# EAGLE design psumon (EAGLE 5.12)
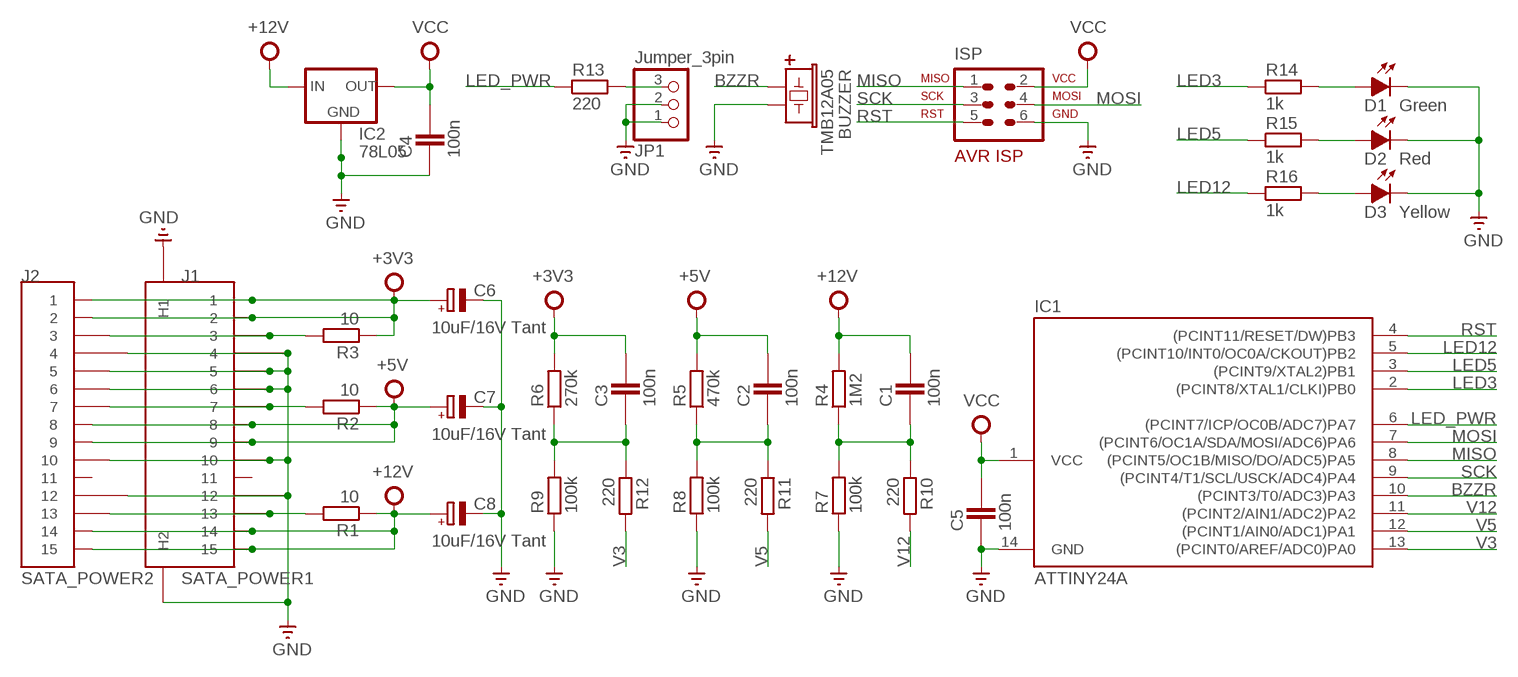
[diagram p0: schematic, sheet 1]

## Parts
BUZZER  TMB12A05  BUZZER_12_7.6  [BUZZER_12_7.6]
C1  100n  CAPACITOR_0805  [C0805]
C2  100n  CAPACITOR_0805  [C0805]
C3  100n  CAPACITOR_0805  [C0805]
C4  100n  CAPACITOR_0805  [C0805]
C5  100n  CAPACITOR_0805  [C0805]
C6  10uF/16V Tant  CAPACITORP_1206  [C1206P]
C7  10uF/16V Tant  CAPACITORP_1206  [C1206P]
C8  10uF/16V Tant  CAPACITORP_1206  [C1206P]
D1  Green  LED_0805  [D0805]
D2  Red  LED_0805  [D0805]
D3  Yellow  LED_0805  [D0805]
IC1  ATTINY24A  TINY24/44/84-SSU  [SOIC14]
IC2  78L05  L78LXXCU/BU  [SOT89]
ISP  AVR-ISP-6VERT  [AVR-ISP-6]
J1  SATA_POWER1  [SATA_POWER1]
J2  SATA_POWER2  [SATA_POWER2]
JP1  Jumper_3pin  PINHD-1X3_2.54-90°  [1X03/90]
R1  10  RESISTOR_0805  [R0805]
R2  10  RESISTOR_0805  [R0805]
R3  10  RESISTOR_0805  [R0805]
R4  1M2  RESISTOR_0805  [R0805]
R5  470k  RESISTOR_0805  [R0805]
R6  270k  RESISTOR_0805  [R0805]
R7  100k  RESISTOR_0805  [R0805]
R8  100k  RESISTOR_0805  [R0805]
R9  100k  RESISTOR_0805  [R0805]
R10  220  RESISTOR_0805  [R0805]
R11  220  RESISTOR_0805  [R0805]
R12  220  RESISTOR_0805  [R0805]
R13  220  RESISTOR_0805  [R0805]
R14  1k  RESISTOR_0805  [R0805]
R15  1k  RESISTOR_0805  [R0805]
R16  1k  RESISTOR_0805  [R0805]

## Nets
+3V3: C3.2 C6.A J1.P$1 J1.P$2 J2.P$1 J2.P$2 R3.1 R6.2
+5V: C2.2 C7.A J1.P$8 J1.P$9 J2.P$8 J2.P$9 R2.1 R5.2
+12V: C1.2 C8.A IC2.3(IN) J1.P$14 J1.P$15 J2.P$14 J2.P$15 R1.1 R4.2
BZZR: BUZZER.P$1 IC1.10((PCINT3/T0/ADC3)PA3)
GND: BUZZER.P$2 C4.1 C5.1 C6.C C7.C C8.C D1.C D2.C D3.C IC1.14(GND) IC2.2(GND) IC2.4(GND1) ISP.6 J1.P$4 J1.P$5 J1.P$6 J1.P$10 J1.P$12 J1.P$16(H1) J1.P$17(H2) J2.P$4 J2.P$5 J2.P$6 J2.P$10 J2.P$12 JP1.1 JP1.2 R7.1 R8.1 R9.1
LED3: IC1.2((PCINT8/XTAL1/CLKI)PB0) R14.1
LED5: IC1.3((PCINT9/XTAL2)PB1) R15.1
LED12: IC1.5((PCINT10/INT0/OC0A/CKOUT)PB2) R16.1
LED_PWR: IC1.6((PCINT7/ICP/OC0B/ADC7)PA7) R13.1
MISO: IC1.8((PCINT5/OC1B/MISO/DO/ADC5)PA5) ISP.1
MOSI: IC1.7((PCINT6/OC1A/SDA/MOSI/ADC6)PA6) ISP.4
N$1: JP1.3 R13.2
N$2: C1.1 R4.1 R7.2 R10.1
N$3: J1.P$3 J2.P$3 R3.2
N$4: D1.A R14.2
N$5: C2.1 R5.1 R8.2 R11.1
N$6: D2.A R15.2
N$7: C3.1 R6.1 R9.2 R12.1
N$8: D3.A R16.2
N$9: J1.P$7 J2.P$7 R2.2
N$10: J1.P$13 J2.P$13 R1.2
RST: IC1.4((PCINT11/RESET/DW)PB3) ISP.5
SCK: IC1.9((PCINT4/T1/SCL/USCK/ADC4)PA4) ISP.3
V3: IC1.13((PCINT0/AREF/ADC0)PA0) R12.2
V5: IC1.12((PCINT1/AIN0/ADC1)PA1) R11.2
V12: IC1.11((PCINT2/AIN1/ADC2)PA2) R10.2
VCC: C4.2 C5.2 IC1.1(VCC) IC2.1(OUT) ISP.2
Unconnected: J1.P$11 J2.P$11

## Library data of the parts
BUZZER = psumon:BUZZER_*
C1-C5 = psumon:CAPACITOR_
C6-C8 = psumon:CAPACITORP_
D1-D3 = psumon:LED_: LEDS
IC1 = psumon:TINY24/44/84
IC2 = psumon:L78LXXCU/BU: VOLTAGE REGULATOR
ISP = psumon:AVR-ISP-6: AVR ISP-6 Serial Programming Header
J1 = psumon:SATA_POWER
J2 = psumon:SATA_POWER2
JP1 = psumon:PINHD-1X3: PIN HEADER
R1-R16 = psumon:RESISTOR_

## Board
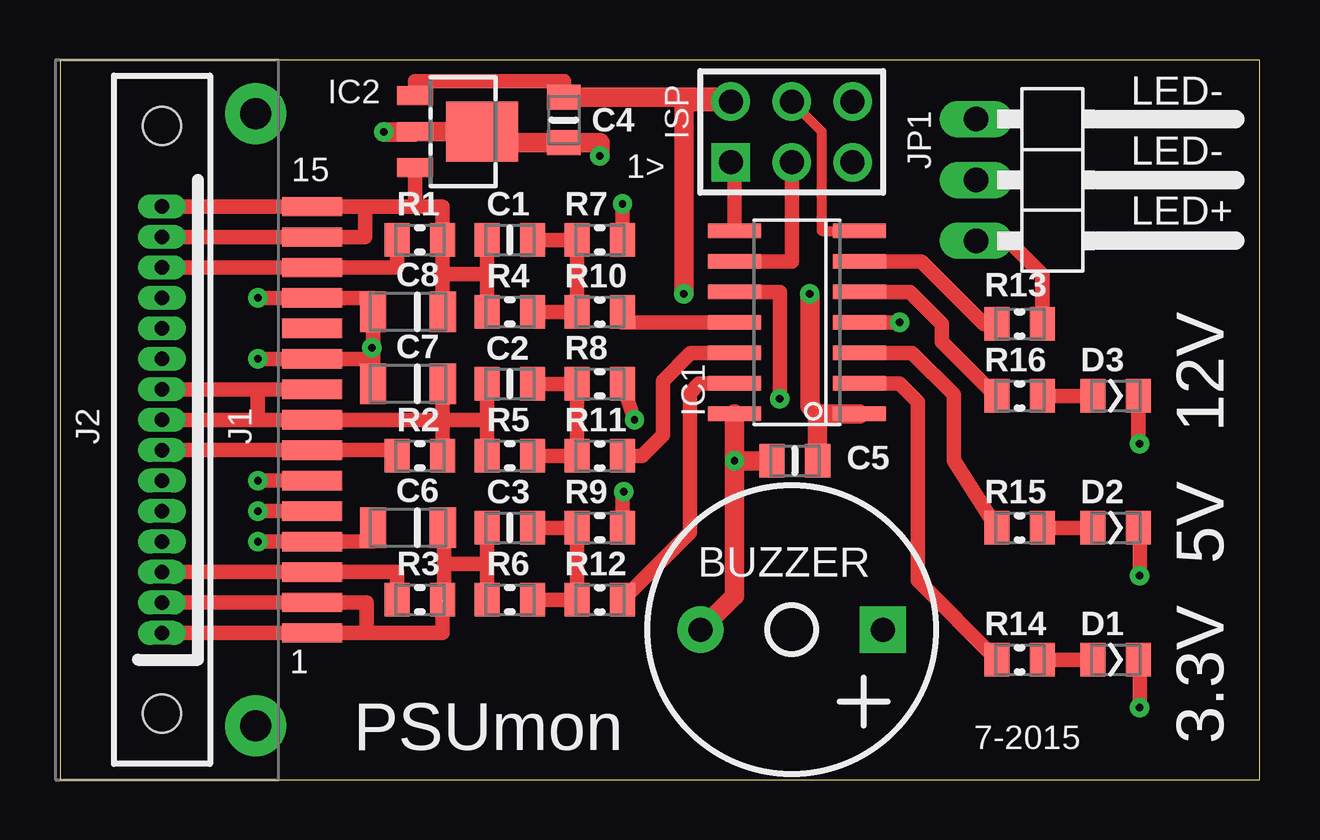
[diagram p1: board, top side]
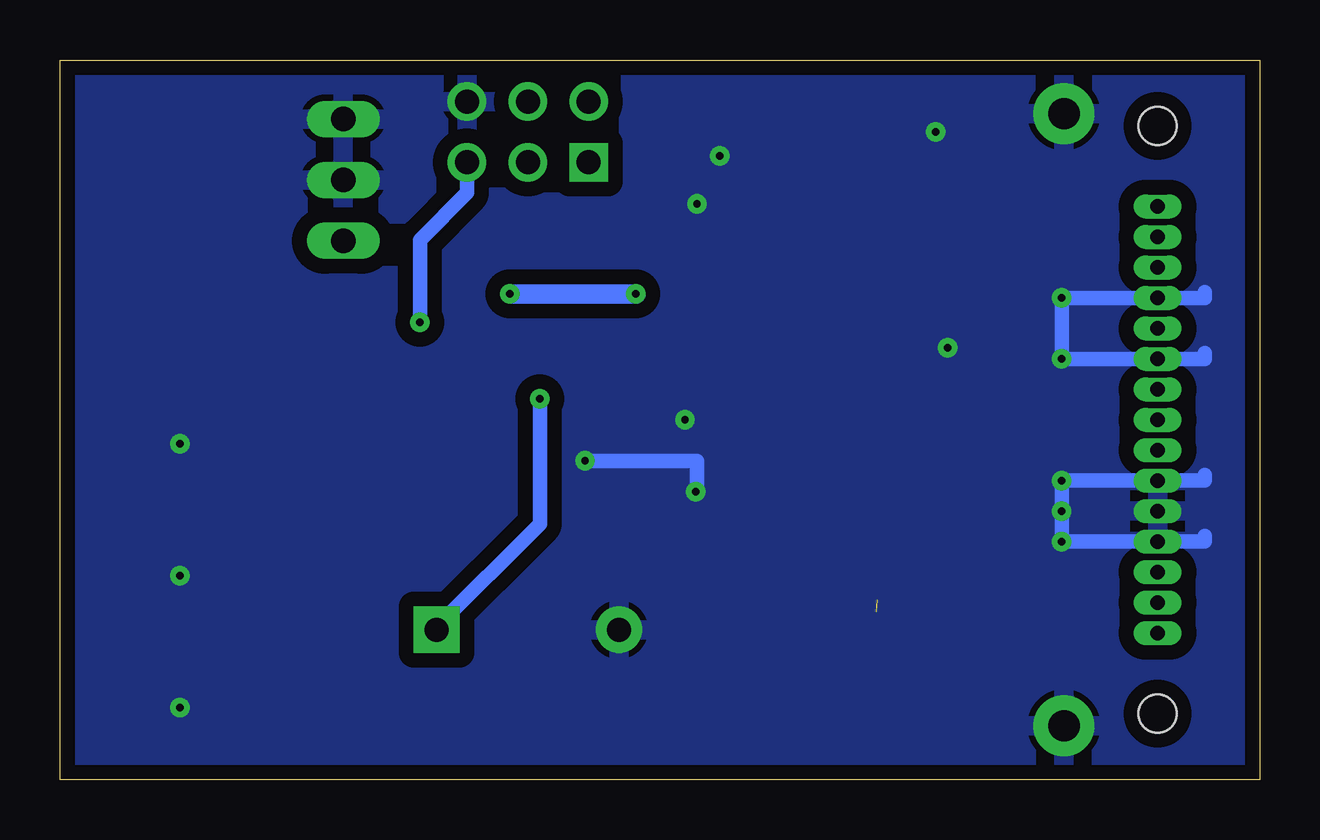
[diagram p2: board, bottom side, seen from below]

Size 50 x 30 mm. Coordinates in mm from the lower left corner, seen from the top.
Outline: 0,0 50,0 50,30 0,30 0,0
Copper layers (1*16): Top 0.035mm / dielectric 1.5mm / Bottom 0.035mm
Design rules "psumon *": minimum track width 7mil, minimum drill 12mil, track to track 7mil, track to pad 7mil, pad to pad 7mil, via to via 7mil, smd to smd 0mil, copper to edge 20mil, drill to drill 10mil, minimum pad ring 8mil, minimum via ring 6mil, stop-mask expansion 2mil, vias tented up to drill 25mil, thermal gap 10mil

### Footprints (pad centres in the part's own frame; a part is rotated, then mirrored left to right if it is on the bottom)
BUZZER_12_7.6 = drill 1 pad 1.93 square: P$1 -3.8,0 | drill 1 pad 1.93 round: P$2 3.8,0
C0805 = smd 1.05 x 1.4: 1 -0.95,0; 2 0.95,0
C1206P = smd 1.1 x 1.7: A -1.45,0; C 1.45,0
D0805 = smd 1.05 x 1.4: A -0.95,0; C 0.95,0
SOIC14 = smd 0.61 x 2.21: 1 -3.81,-2.603; 2 -2.54,-2.603; 3 -1.27,-2.603; 4 0,-2.603; 5 1.27,-2.603; 6 2.54,-2.603; 7 3.81,-2.603; 8 3.81,2.603; 9 2.54,2.603; 10 1.27,2.603; 11 0,2.603; 12 -1.27,2.603; 13 -2.54,2.603; 14 -3.81,2.603
SOT89 = smd 0.8 x 1.5: 1 -1.5,-1.75; 2 0,-1.75; 3 1.5,-1.75 | smd 2.5 x 3: 4 0,1.05
AVR-ISP-6 = drill 1 pad 1.6 square: 1 -2.54,-1.27 | drill 1 pad 1.6 round: 2 -2.54,1.27; 3 0,-1.27; 4 0,1.27; 5 2.54,-1.27; 6 2.54,1.27
SATA_POWER1 = smd 0.8 x 2.5: P$1 8.89,0; P$2 7.62,0; P$3 6.35,0; P$4 5.08,0; P$5 3.81,0; P$6 2.54,0; P$7 1.27,0; P$8 0,0; P$9 -1.27,0; P$10 -2.54,0; P$11 -3.81,0; P$12 -5.08,0; P$13 -6.35,0; P$14 -7.62,0; P$15 -8.89,0 | drill 1.3 pad 2.54 round: P$16 -12.765,-2.36; P$17 12.765,-2.36
SATA_POWER2 = drill 0.6 pad 0.8 long: P$1 -8.89,0; P$2 -7.62,0; P$3 -6.35,0; P$4 -5.08,0; P$5 -3.81,0; P$6 -2.54,0; P$7 -1.27,0; P$8 0,0; P$9 1.27,0; P$10 2.54,0; P$11 3.81,0; P$12 5.08,0; P$13 6.35,0; P$14 7.62,0; P$15 8.89,0 | hole 1.6: -12.25,0; 12.25,0
1X03/90 = drill 1.016 long: 1 -2.54,-3.81; 2 0,-3.81; 3 2.54,-3.81
R0805 = smd 1.05 x 1.4: 1 -0.95,0; 2 0.95,0

### Placement (x,y rotation side)
BUZZER  30.5,6.25 180 top
C1  18.75,22.5 180 top
C2  18.75,16.5 180 top
C3  18.75,10.5 180 top
C4  21,27.5 90 top
C5  30.63,13.29 0 top
C6  14.5,10.5 180 top
C7  14.5,16.5 180 top
C8  14.5,19.5 180 top
D1  44,5 0 top
D2  44,10.5 0 top
D3  44,16 0 top
IC1  30.72,19.06 90 top
IC2  16.55,27.01 270 top
ISP  30.5,27 0 top
J1  10.51,15 270 top
J2  4.25,15 90 top
JP1  42,25 270 top
R1  15,22.5 180 top
R2  15,13.5 180 top
R3  15,7.5 180 top
R4  18.75,19.5 180 top
R5  18.75,13.5 180 top
R6  18.75,7.5 180 top
R7  22.5,22.5 180 top
R8  22.5,16.5 180 top
R9  22.5,10.5 180 top
R10  22.5,19.5 0 top
R11  22.5,13.5 0 top
R12  22.5,7.5 0 top
R13  40,19 0 top
R14  40,5 0 top
R15  40,10.5 0 top
R16  40,16 0 top

### Tracks (layer width: path | path; a pad name or v marks a point on that pad's centre or on a via)
+3V3  (1 unrouted)
  Top 0.61: R3.1 15.95,6.11 12.79,6.11 | 12.79,6.11 J1.P$1 J2.P$1 | J2.P$2 J1.P$2 12.79,7.38 12.79,6.11 | 17.8,9 R6.2 | 17.8,9 C3.2 | C6.A 16,10.5 16,9 | 16,7 16,9 | 16,9 17.8,9
+5V
  Top 0.61: 15.95,15 R2.1 | 15.95,15 J1.P$8 8.24,15 | 8.24,16.27 J2.P$9 | 8.24,16.27 J1.P$9 | J2.P$8 8.24,15 | 17.8,15 C2.2 | 15.95,15 C7.A | 15.95,15 17.8,15 | 8.24,15 8.24,16.27 | 17.8,15 R5.2
+12V
  Top 0.61: 12.71,23.89 J1.P$15 J2.P$15 | 12.71,23.89 14.8,23.89 | 14.8,23.89 IC2.3 | 14.8,23.89 15.95,23.89 R1.1 15.95,21.07 | J2.P$14 J1.P$14 12.71,22.62 12.71,23.89 | 15.95,21.07 C8.A | 17.8,21.07 C1.2 | 15.95,21.07 17.8,21.07 | 17.8,21.07 R4.2
BZZR  (via drill 0.3 pad 0.8)
  Top 0.61: IC1.10 30,20.33 v30,15.88
  Bottom 0.61: v30,15.88 30,10.66 34.3,6.36 BUZZER.P$1
GND  (via drill 0.3 pad 0.8)
  Top 0.61: R7.1 v23.45,24 | R9.1 23.45,12 v23.5,12 | v23.95,15 R8.1 | v8.25,20.08 J1.P$12 13.05,20.08 C8.C C7.C | v8.25,17.54 J1.P$10 13,17.54 13,17.5 | v8.25,11.19 J1.P$5 | v8.25,9.92 J1.P$4 13.05,9.92 C6.C 13,10.5 13,10 | v8.25,12.46 J1.P$6 | D2.C 45,10.5 v45,8.5 | D1.C 45,5 v45,3 | D3.C 44.95,14.05 v45,14
  Top 0.813: v28.12,13.29 IC1.14 | v28.12,13.29 C5.1 | v13.5,27 IC2.2 IC2.4 17.6,26.55 C4.1 22.5,26.55 v22.5,26 | v28.12,13.29 28.12,7.67 BUZZER.P$2
  Bottom 0.61: v23.5,12 23.45,12 23.45,13.29 v28.12,13.29 | 2.29,20.32 2.29,20.08 J2.P$12 v8.25,20.08 v8.25,17.54 J2.P$10 2.29,17.54 2.29,17.78 | 2.29,12.7 2.29,12.46 v8.25,12.46 v8.25,11.19 v8.25,9.92 2.29,9.92 2.29,10.16
  other vias: 13,18
  pour Bottom (isolate 0.61): 0.5,29.5 49.5,29.5 49.5,0.5 0.5,0.5
LED3
  Top 0.61: IC1.2 34.98,16.52 35.75,15.75 35.75,8.3 R14.1
LED5
  Top 0.61: IC1.3 35.51,17.79 37.25,16.05 37.25,13.3 R15.1
LED12
  Top 0.61: IC1.5 35.42,20.33 36.75,19 36.75,18.25 39,16 R16.1
LED_PWR
  Top 0.61: IC1.6 35.9,21.6 38.5,19 R13.1
MISO
  Top 0.61: IC1.8 28.12,25.69 ISP.1
MOSI
  Top 0.406: ISP.4 31.75,27.02 31.75,22.87 IC1.7
N$1
  Top 0.61: R13.2 40.95,21.05 39.54,22.46 JP1.3
N$2
  Top 0.61: C1.1 R7.2 R10.1 R4.1
N$3
  Top 0.61: R3.2 14.05,8.65 J1.P$3 J2.P$3
N$4
  Top 0.61: D1.A R14.2
N$5
  Top 0.61: C2.1 R8.2 R11.1 R5.1
N$6
  Top 0.61: D2.A R15.2
N$7
  Top 0.61: R6.1 R12.1 R9.2 C3.1
N$8
  Top 0.61: D3.A R16.2
N$9
  Top 0.61: 14.05,13.61 R2.2 14.05,13.73 J1.P$7 J2.P$7
N$10
  Top 0.61: R1.2 14.05,21.35 J1.P$13 J2.P$13
RST  (via drill 0.3 pad 0.8)
  Top 0.61: IC1.4 v35,19.06
  Bottom 0.61: v35,19.06 35,22.5 33.04,24.46 ISP.5
SCK
  Top 0.61: IC1.9 30.5,21.6 ISP.3
V3
  Top 0.61: IC1.13 26.64,16.52 26.25,16.12 26.25,10.3 R12.2
V5
  Top 0.61: IC1.12 26.29,17.79 25.12,16.62 25.12,14.38 24.25,13.5 R11.2
V12
  Top 0.61: IC1.11 23.45,19.06 R10.2
VCC  (via drill 0.3 pad 0.8)
  Top 0.61: IC2.1 14.8,29.12 21,29.12 C4.2
  Top 0.813: C4.2 27.96,28.45 ISP.2 26,28.27 v26,20.25 | 31.58,15.25 C5.2 | 31.58,15.25 IC1.1 | 31.58,15.25 31.25,15.58 v31.25,20.25
  Bottom 0.813: v26,20.25 v31.25,20.25

### Text on the board
tPlace: LED- | LED- | 15 | 1> | LED+ | 12V | 5V | 1 | 3.3V | PSUmon | 7-2015